# EAGLE design LaserZ-V2 (EAGLE 8.2.2)
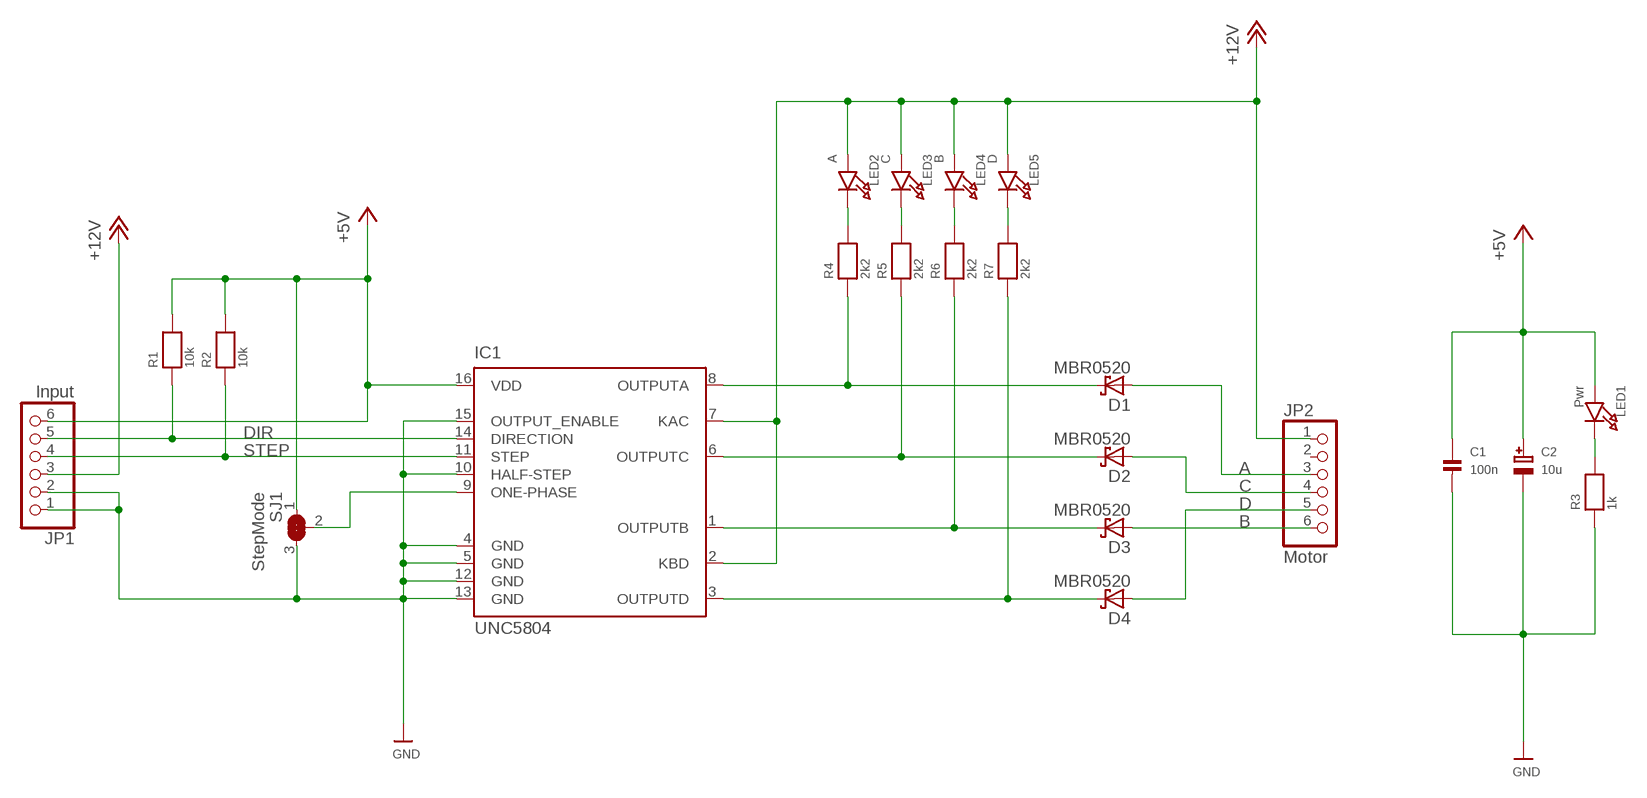
[diagram p0: schematic, sheet 1]

## Parts
C1  100n  CAP_CERAMIC0805  [0805]
C2  10u  CAP_TANTALUMA/3216_WAVE  [EIA3216-18/A-W]
D1  MBR0520  [SOD123]
D2  MBR0520  [SOD123]
D3  MBR0520  [SOD123]
D4  MBR0520  [SOD123]
IC1  UNC5804  UNC5804LB  [SO-16DW]
JP1  Input  PINHD-1X6  [1X06]
JP2  Motor  PINHD-1X6  [1X06]
LED1  Pwr  LED0805  [CHIPLED_0805]
LED2  A  LED0805  [CHIPLED_0805]
LED3  C  LED0805  [CHIPLED_0805]
LED4  B  LED0805  [CHIPLED_0805]
LED5  D  LED0805  [CHIPLED_0805]
R1  10k  RESISTOR0805  [0805]
R2  10k  RESISTOR0805  [0805]
R3  1k  RESISTOR0805  [0805]
R4  2k2  RESISTOR0805  [0805]
R5  2k2  RESISTOR0805  [0805]
R6  2k2  RESISTOR0805  [0805]
R7  2k2  RESISTOR0805  [0805]
SJ1  StepMode  SOLDERJUMPER_2WAY  [SOLDERJUMPER_2WAY_OPEN_NOPASTE]

## Nets
+5V: C1.1 C2.+ IC1.16(VDD) JP1.6 LED1.A R1.2 R2.2 SJ1.1
+12V: IC1.2(KBD) IC1.7(KAC) JP1.3 JP2.1 LED2.A LED3.A LED4.A LED5.A
A: D1.A JP2.3
B: D3.A JP2.6
C: D2.A JP2.4
D: D4.A JP2.5
DIR: IC1.14(DIRECTION) JP1.5 R1.1
GND: C1.2 C2.- IC1.4(GND) IC1.5(GND) IC1.10(HALF-STEP) IC1.12(GND) IC1.13(GND) IC1.15(OUTPUT_ENABLE) JP1.1 JP1.2 R3.1 SJ1.3
N$1: D1.C IC1.8(OUTPUTA) R4.1
N$2: D2.C IC1.6(OUTPUTC) R5.1
N$3: D3.C IC1.1(OUTPUTB) R6.1
N$4: D4.C IC1.3(OUTPUTD) R7.1
N$5: LED1.C R3.2
N$6: IC1.9(ONE-PHASE) SJ1.2
N$7: LED2.C R4.2
N$8: LED3.C R5.2
N$9: LED4.C R6.2
N$10: LED5.C R7.2
STEP: IC1.11(STEP) JP1.4 R2.1
Unconnected: JP2.2

## Library data of the parts
C1 = microbuilder:CAP_CERAMIC: Ceramic Capacitors 0402 - 0402 Surface Mount Capacitors 16pF 50V 5% [Digikey: 445-4899-2-ND] 18pF 50V 5% [Digikey: 490-1281-2-ND] 22pF 50V 5% [Digikey: 490-1283-2-ND] 68pF 50V 5% [Digikey: 490-1289-2-ND] 0.1uF 10V 10% [Digikey: 490-1318-2-ND] 1.0uF 6.3V 10% [Digikey: 490-1320-2-ND] 0603 - 0603 Surface Mount Capacitors 16 pF 50V 5% [Digikey: 445-5051-2-ND] 22 pF 50V [Digikey: PCC220ACVTR-ND] 33 pF 50V 5% [Digikey: 490-1415-1-ND] 56pF 50V 5% [Digikey: 490-1421-1-ND] 220pF 50V 5% [Digikey: 445-1285-1-ND] 680 pF 50V 2200 pF 50V 5% C0G [Digikey: 445-1297-1-ND] 5600 pF 100V 5% X7R [Digikey: 478-3711-1-ND] 0.1 µF 25V 10% [Digikey: PCC2277TR-ND] 0.22 µF 16V 10% X7R [Digikey: 445-1318-1-ND] 1.0 µF 25V 10% [Digikey: 445-5146-2-ND] 0603 - RF Specific 3pF 250V +/-0.1pF RF [Digikey: 712-1347-1-ND] 18 pF 250V 5% [Digikey: 478-3505-1-ND or 712-1322-1-ND] 56 pF 250V 5% C0G RF [Digikey: 490-4867-1-ND] 68 pF 250V RF [Digikey: 490-4868-1-ND] 0805 - 0805 Surface Mount Capacitors 220 pF 250V 2% RF Ceramic Capacitor [Digikey: 712-1398-1-ND] 1000 pF 50V 2% NP0 Ceramic Capacitor [Digikey: 478-3760-1-ND] 0.1 µF 25V 10% Ceramic Capacitor [Digikey: PCC1828TR-ND] 1.0 µF 16V 10% Ceramic Capacitor[Digikey: 490-1691-2-ND] 10.0 µF 10V 10% Ceramic Capacitor[Digikey: 709-1228-1-ND] 10.0 uF 16V 10% Ceramic Capacitor [Digikey: 478-5165-2-ND] 47 uF 6.3V 20% Ceramic Capacitor [Digikey: 587-1779-1-ND or 399-5506-1-ND] 1206 - 1206 Surface Mount Capacitors 47uF 10V 20% Ceramic Capacitor [Digikey: 490-5528-1-ND or 399-5508-1-ND or 445-6010-1-ND] 100uF 6.3V -20%, +80% Y5V Ceramic Capacitor (Digikey: 490-4512-1-ND, Mouser: 81-GRM31CF50J107ZE1L)
C2 = microbuilder:CAP_TANTALUM: Tantalum Capacitors Wave footprints have larger pads and are meant to be used for hand soldering. Reflow footprints are optimised for solder paste and a reflow oven. EIA3216-18/A-[R/W] - Size A / 3216-18 / 1206 footprint 4.7µF 25V 10% Tantalum Capacitor 10µF 16V 10% Tantalum Capacitor [Digikey: 495-2236-2-ND] EIA3528-21/B-[R/W] - Size B / 3528-21 47µF 10V 10% Tantalum Capactior [Digikey: 495-2216-1-ND] EIA6032-28/C-[R/W] - Size C / 6032-28 10µF 35V 20% Tantalum Capacitor [Digikey: 495-2285-1-ND] 100µF 16V 10% Tantalum Capactior [Digikey: 399-5214-1-ND]
D1-D4 = Peters:MBR0520
IC1 = allegro:UNC5804: BiMOS II UNIPOLAR STEPPER-MOTOR TRANSLATOR/DRIVER Source: 5804.pdf; OC_FARNELL: unknown; OC_NEWARK: unknown
JP1 JP2 = pinhead:PINHD-1X6: PIN HEADER
LED1-LED5 = Adafruit Ultimate GPS:LED: LED 0603 - 0603 Surface Mount Package 2mA: Green LED - Low Power (3.9mcd, 2ma, 1.7Vf) - Digikey: 475-2709-2-ND Orange LED - Low Power (9.8mcd, 2ma, 1.8Vf) - Digikey: 475-1194-2-ND Red LED - Low Power (5mcd, 2ma, 1.8Vf) - Digikey: 475-1195-2-ND Yellow LED - Low Power (7mcd, 2ma, 1.8Vf) - Digikey: 475-1196-2-ND 5mA: Blue LED - Low Power (17mcd, 5ma, 2.9Vf) - Digikey: LNJ937W8CRACT-ND 0805 - 0805 Surface Mount Package 2mA: Red LED (8.8mcd, 2mA, 1.8Vf, Clear) - Low Power [Digikey: 475-2510-1-ND] Green LED (5mcd, 2mA, 1.8Vf, Clear) - Low Power [Digikey: 475-2730-1-ND] Yellow LED (11.3mcd, 2mA, 1.8Vf, Clear) - Low Power [Digikey: 475-2555-1-ND] 20mA: Red LED (104mcd, 20mA, Diffused) - LS R976 [Digikey: 475-1278-6-ND] Red LED (12mcd, 20mA, 2.0Vf, Clear) - APT2012EC [Digikey: 754-1128-1-ND] Green LED (15mcd, 20mA, 2.2Vf, Clear) - APT2012GC [Digikey: 754-1131-1-ND] Orange LED (160mcd, 20mA, 2.1Vf, Clear) - APT2012SECK [Digikey: 754-1130-1-ND] 1206 - 1206 Surface Mount Package Green LED (26mcd, 20mA, Diffused) - LG N971 [Digikey: 475-1407-6-ND] Red LED (15mcd, 20mA, Diffused) - LH N974 [Digikey: 475-1416-6-ND]
R1-R7 = Adafruit Ultimate GPS:RESISTOR: Resistors 0402 - 0402 Surface Mount Package 22 Ohm 1% 1/16W [Digikey: 311-22.0LRTR-ND] 33 Ohm 5% 1/16W 1.0K 5% 1/16W 1.5K 5% 1/16W 2.0K 1% 1/16W 10.0K 1% 1/16W [Digikey: 311-10.0KLRTR-ND] 10.0K 5% 1/16W [Digikey: RMCF0402JT10K0TR-ND] 12.1K 1% 1/16W [Digikey: 311-22.0LRTR-ND] 100.0K 5% 1/16W 0603 - 0603 Surface Mount Package 0 Ohm 1/10 Watt 1% Resistor 15 Ohm 1/10 Watt 1% Resistor 33 Ohm 1/10 Watt 1% Resistor 49.9 Ohm 1/10 Watt 1% Resistor 100 Ohm 1/10 Watt 1% Resistor 150 Ohm 1/10 Watt 1% Resistor 240 Ohm 1/10 Watt 1% Resistor 390 Ohm 1/10 Watt 1% Resistor 560 Ohm 1/10 Watt 1% Resistor 680 Ohm 1/10 Watt 1% Resistor 750 Ohm 1/10 Watt 1% Resistor 1.0K Ohm 1/10 Watt 1% Resistor 1.5K Ohm 1/10 Watt 1% Resistor 2.0K Ohm 1/10 Watt 1% Resistor 2.2K Ohm 1/10 Watt 1% Resistor 3.3K Ohm 1/10 Watt 1% Resistor 4.7K Ohm 1/10 Watt 1% Resistor 10.0K Ohm 1/10 Watt 1% Resistor 12.0K Ohm 1/10 Watt 1% Resistor 12.1K Ohm 1/10 Watt 1% Resistor 20.0K Ohm 1/10 Watt 1% Resistor 33.0K Ohm 1/10 Watt 1% Resistor 100.0K Ohm 1/10 Watt 1% Resistor 0805 - 0805 Surface Mount Package 0 Ohm 1/8 Watt 1% Resistor 33 Ohm 1/8 Watt 1% Resistor 100 Ohm 1/8 Watt 1% Resistor 150 Ohm 1/8 Watt 1% Resistor 200 Ohm 1/8 Watt 1% Resistor 240 Ohm 1/8 Watt 1% Resistor 330 Ohm 1/8 Watt 1% Resistor 390 Ohm 1/8 Watt 1% Resistor 470 Ohm 1/8 Watt 1% Resistor 1.0K Ohm 1/8 Watt 1% Resistor 1.5K Ohm 1/8 Watt 1% Resistor 2.0K Ohm 1/8 Watt 1% Resistor 4.7K Ohm 1/8 Watt 1% Resistor 5.1K Ohm 1/8 Watt 1% Resistor 5.6K Ohm 1/8 Watt 1% Resistor 10.0K Ohm 1/8 Watt 1% Resistor 22.0K Ohm 1/8 Watt 1% Resistor 33.0K Ohm 1/8 Watt 1% Resistor 100K Ohm 1/8 Watt 1% Resistor 1206 - 1206 Surface Mount Package 2012 - 2010 Surface Mount Package 0.11 Ohm 1/2 Watt 1% Resistor - Digikey: RHM.11UCT-ND
SJ1 = microbuilder:SOLDERJUMPER_2WAY: 2-Way Solder Jumper

## Board
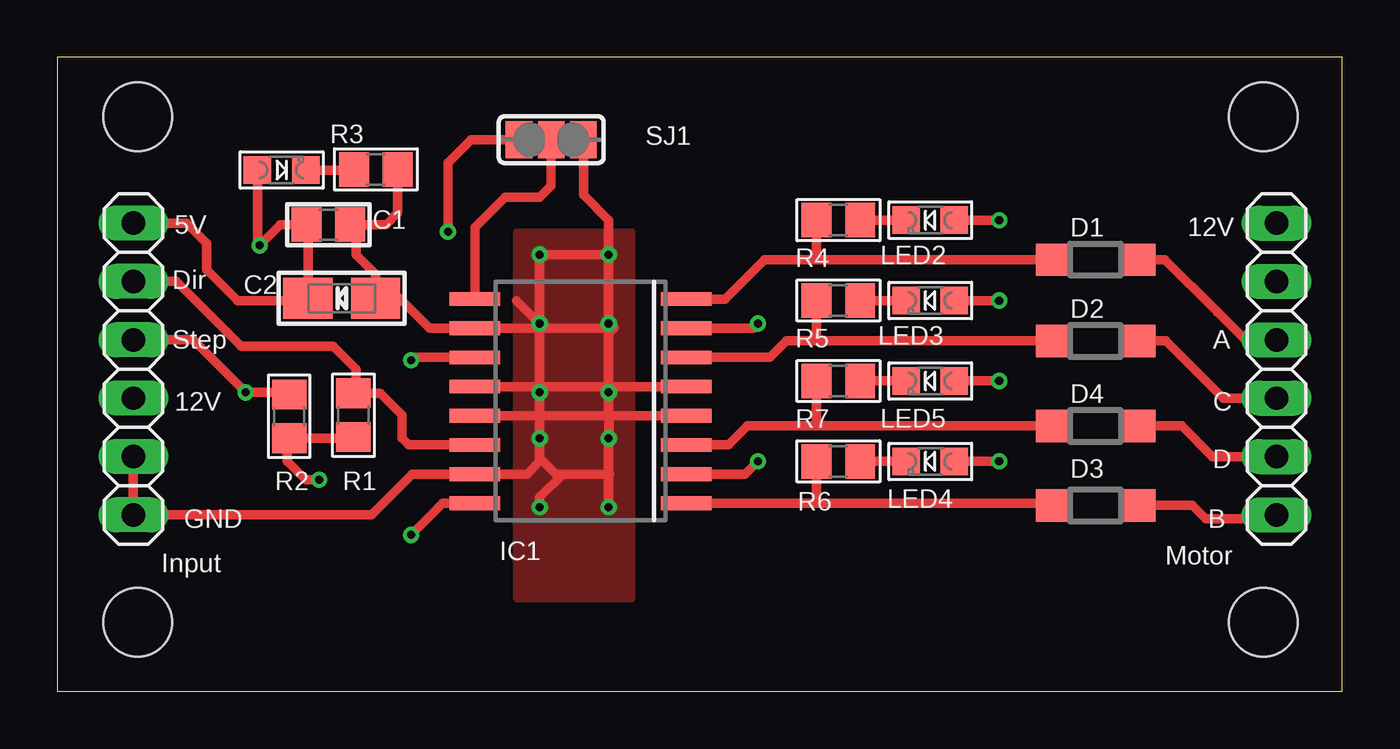
[diagram p1: board, top side]
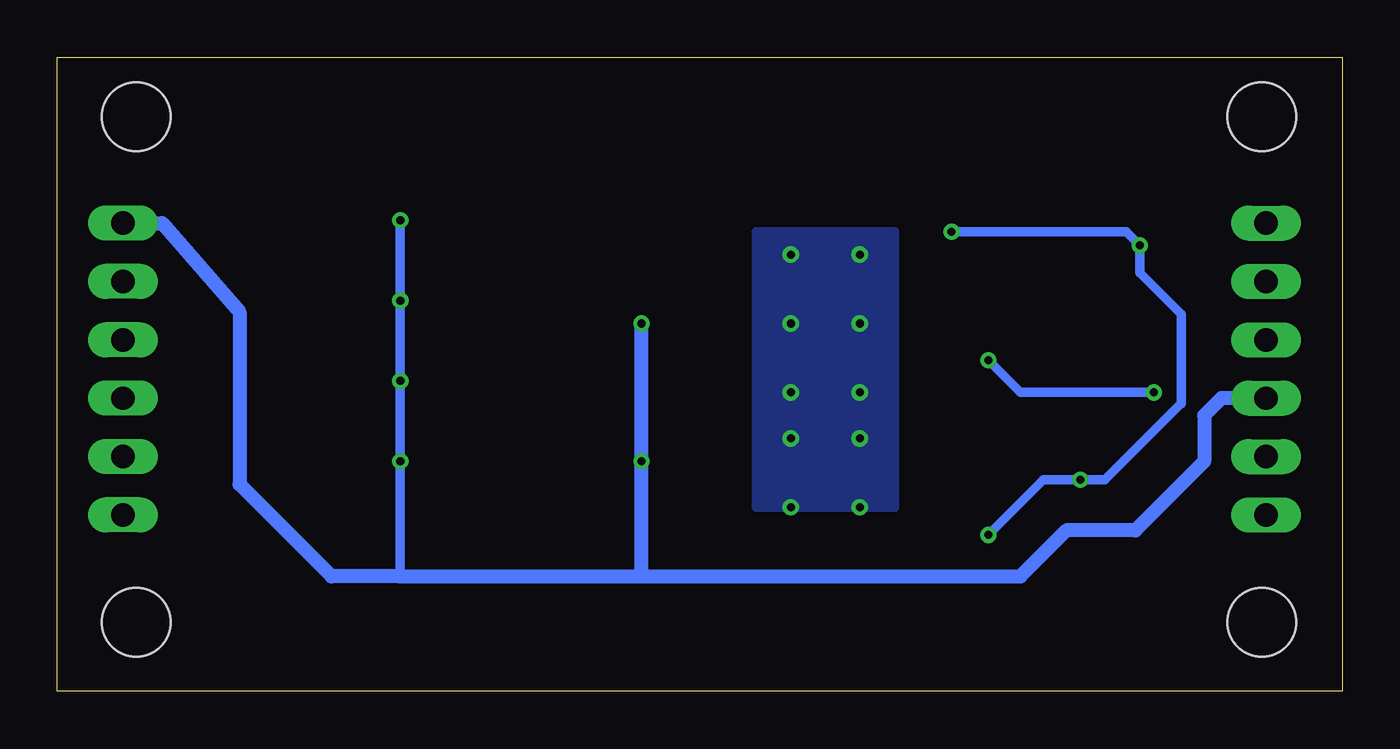
[diagram p2: board, bottom side, seen from below]

Size 55.93 x 27.58 mm. Coordinates in mm from the lower left corner, seen from the top.
Outline: 0,0 55.93,0 55.93,27.58 0,27.58 0,0
Copper layers (1*16): Top 0.0356mm / dielectric 1.5011mm / Bottom 0.0356mm
Design rules "oshpark-2layer": minimum track width 6mil, minimum drill 13mil, track to track 6mil, track to pad 6mil, pad to pad 6mil, via to via 6mil, smd to smd 6mil, copper to edge 15mil, drill to drill 6mil, minimum pad ring 7mil, minimum via ring 7mil, stop-mask expansion 2.5mil, vias tented up to drill 0mil, thermal gap 10mil
Holes 3 mm at 3.5,25 52.5,25 3.5,3 52.5,3

### Footprints (pad centres in the part's own frame; a part is rotated, then mirrored left to right if it is on the bottom)
0805 = smd 1.3 x 1.5: 1 -0.95,0; 2 0.95,0
EIA3216-18/A-W = smd 2.15 x 1.8: + 1.475,0; - -1.475,0
SOD123 = smd 1.4 x 1.4: A 1.265,0; C -2.535,0
SO-16DW = smd 0.6 x 2.2: 1 -4.445,-4.6; 2 -3.175,-4.6; 3 -1.905,-4.6; 4 -0.635,-4.6; 5 0.635,-4.6; 6 1.905,-4.6; 7 3.175,-4.6; 8 4.445,-4.6; 9 4.445,4.6; 10 3.175,4.6; 11 1.905,4.6; 12 0.635,4.6; 13 -0.635,4.6; 14 -1.905,4.6; 15 -3.175,4.6; 16 -4.445,4.6
1X06 = drill 1.016 long: 1 -6.35,0; 2 -3.81,0; 3 -1.27,0; 4 1.27,0; 5 3.81,0; 6 6.35,0
CHIPLED_0805 = smd 1.2 x 1.2: A 0,-1.05; C 0,1.05
SOLDERJUMPER_2WAY_OPEN_NOPASTE = smd 1.168 x 1.6: 1 -1.397,0; 2 0,0; 3 1.397,0

### Placement (x,y rotation side)
C1  11.8,20.3 0 top
C2  12.38,17.1 180 top
D1  45.83,18.78 0 top
D2  45.83,15.24 0 top
D3  45.83,8.08 0 top
D4  45.83,11.54 0 top
IC1  22.78,12.62 90 top
JP1  3.31,14.02 90 top
JP2  53.08,14.02 270 top
LED1  9.76,22.68 270 top
LED2  38,20.5 90 top
LED3  38,17 90 top
LED4  38,10 90 top
LED5  38,13.5 90 top
R1  12.89,12.01 270 top
R2  10.09,11.96 270 top
R3  13.86,22.71 180 top
R4  34,20.5 0 top
R5  34,17 0 top
R6  34,10 0 top
R7  34,13.5 0 top
SJ1  21.5,24 0 top

### Tracks (layer width: path | path; a pad name or v marks a point on that pad's centre or on a via)
+5V  (via drill 0.35)
  Top 0.406: 10.11,11.01 R2.2 | 10.11,11.01 12.84,11.01 R1.2 | v11.4,9.2 10.8,9.2 10,10 10,10.9 10.11,11.01 | IC1.16 16.77,8.18 v15.4,6.8 | 10.76,20.3 C1.1 10.9,20.25 C2.+ 10.8,17 7.84,17 6.5,18.34 6.5,19.5 5.63,20.37 JP1.6 | 10.76,20.3 9.7,20.3 v8.8,19.4 8.71,19.49 LED1.A | 11,20.54 10.76,20.3 | v17,20 17,23 18,24 SJ1.1
  Bottom 0.406: v15.4,6.8 13,9.2 v11.4,9.2 10.32,9.2 7.02,12.5 7,12.5 7,16.4 8.8,18.2 v8.8,19.4 9.4,20 v17,20
+12V  (via drill 0.35)
  Top 0.406: IC1.7 30.3,15.79 v30.5,16 | IC1.2 29.95,9.45 v30.5,10 | LED4.A v41,10 | LED5.A v41,13.5 | LED3.A v41,17 | LED2.A v41,20.5
  Bottom 0.406: v41,20.5 v41,17 v41,13.5 v41,10 41,5.03 41.03,5
  Bottom 0.61: 30.4,5 14,5 12,7 9,7 6,10 6,12 5.25,12.75 JP1.3 | 30.4,5 41.03,5 44,5 48,9 48,16.5 51.37,20.37 JP2.1 | 30.4,5 30.5,5.1 v30.5,10 v30.5,16
A
  Top 0.406: D1.A 48.22,18.78 50.48,16.52 | 50.48,16.52 50.5,16.5 | JP2.3 51.71,15.29 50.48,16.52
B
  Top 0.406: D3.A 49.42,8.08 50,7.5 52.91,7.5 JP2.6
C
  Top 0.406: D2.A 48.26,15.24 50.75,12.75 JP2.4
D
  Top 0.406: D4.A 48.96,11.54 50.29,10.21 JP2.5
DIR
  Top 0.406: IC1.14 15.29,10.71 15,11 15,12 14.04,12.96 R1.1 13,13.07 13,14 12,15 8,15 5.17,17.83 JP1.5
GND  (via drill 0.35)
  Top 0.406: 21,12.08 v21,13 21,13.13 | 21,12.08 21,11.91 | 21,13.13 21,15.7 | 21,10.15 v21,11 21,11.91 | 21,10.15 21,10 20.45,9.45 IC1.15 15.45,9.45 13.67,7.67 JP1.1 JP1.2 | 21,15.7 v21,16 | v21,16 20,17 | 21,15.7 21.09,15.79 24.24,15.79 24,15.56 v24,13 24,11.99 24.01,11.98 | 21,15.7 20.91,15.79 IC1.10 16.2,15.79 14.9,17.1 C2.- | IC1.13 20.92,11.98 21,11.91 | IC1.12 20.87,13.26 21,13.13 | 24.05,9.45 22.01,9.45 | 22.01,9.45 21.7,9.45 21,10.15 | IC1.5 21.13,13.26 21,13.13 | 24.01,11.98 IC1.4 | 24.01,11.98 21.09,11.98 21,12.08 | 13.89,17.07 C2.- | C2.- 13.86,18.14 13,19 13,20.05 C1.2 | C1.2 | 24.01,11.98 v24.01,11 v24,11 24,9.49 24.05,9.45 | v21,8 21,8.43 22.01,9.45 | v24,8 24,9.4 24.05,9.45 | 23.9,19 21.26,19 | 23.9,19 v24,19 | 21.26,19 v21,19 | v21,16 21,18.74 21.26,19 | 24,18.9 v24,16 | 24,18.9 23.9,19 | C1.2 14.3,20.3 14.81,20.81 R3.1 | SJ1.3 22.9,21.6 24,20.5 24,18.9
  pour Top (isolate 0.305): 20,4 20,20 25,20 25,4
  pour Bottom: 19.5,20 19.5,8 25.5,8 25.5,20
N$1
  Top 0.406: IC1.8 29.07,17.07 30.78,18.78 33.21,18.78 | 33.21,18.78 D1.C | R4.1 33.05,18.94 33.21,18.78
N$2
  Top 0.406: IC1.6 31.02,14.53 31.74,15.24 32.92,15.24 | 32.92,15.24 D2.C | R5.1 33.05,15.37 32.92,15.24
N$3
  Top 0.406: 33.07,8.18 IC1.1 | 33.07,8.18 43.2,8.18 D3.C | R6.1 33.05,8.19 33.07,8.18
N$4
  Top 0.406: IC1.3 29.21,10.71 30.04,11.54 33.15,11.54 | 33.15,11.54 D4.C | R7.1 33.05,11.64 33.15,11.54
N$5
  Top 0.406: LED1.C 12.38,22.68 R3.2
N$6
  Top 0.406: IC1.9 18.18,20.18 19.5,21.5 21,21.5 21.5,22 SJ1.2
N$7
  Top 0.406: R4.2 LED2.C
N$8
  Top 0.406: R5.2 LED3.C
N$9
  Top 0.406: R6.2 LED4.C
N$10
  Top 0.406: R7.2 LED5.C
STEP  (via drill 0.35)
  Top 0.406: R2.1 10,13 v8.2,13 5.91,15.29 JP1.4 | IC1.11 15.53,14.53 v15.4,14.4
  Bottom 0.406: v8.2,13 14,13 v15.4,14.4

### Text on the board
tNames: 5V | 12V | Dir | Step | A | 12V | C | D | GND | B